# Altium schematic sheet Adapter.SchDoc
size A3; Address1: Address1; Address2: Address2; Address3: Address3; Address4: Address4
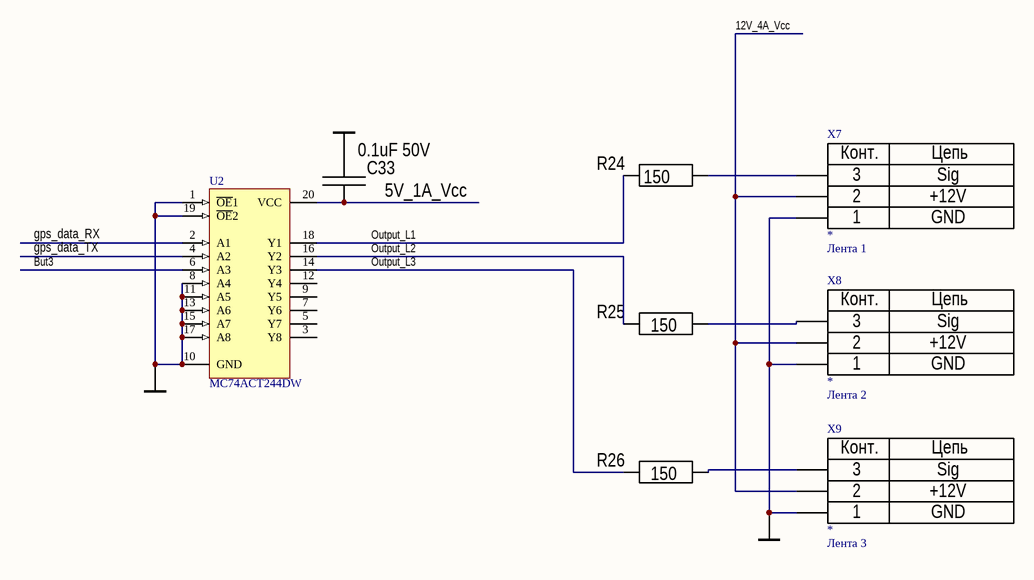
[diagram p0: Adapter.SchDoc]

## Parts
C33  0.1uF 50V  [0805_CAP]
R24  150  [0805_RES]
R25  150  [0805_RES]
R26  150  [0805_RES]
U2  MC74ACT244DW  [751D-04_N]
X7  *  Destiny: Лента 1  [3pad_5.08]
X8  *  Destiny: Лента 2  [3pad_5.08]
X9  *  Destiny: Лента 3  [3pad_5.08]

## Nets
GND: C33.2 U2.1(~{OE}1) U2.8(A4) U2.10(GND) U2.11(A5) U2.13(A6) U2.15(A7) U2.17(A8) U2.19(~{OE}2) X7.1 X8.1 X9.1
5V_1A_Vcc: C33.1 U2.20(VCC)
12V_4A_Vcc: X7.2 X8.2 X9.2
But3: U2.6(A3)
gps_data_RX: U2.2(A1)
gps_data_TX: U2.4(A2)
Output_L1: R24.1 U2.18(Y1)
Output_L2: R25.1 U2.16(Y2)
Output_L3: R26.1 U2.14(Y3)
NetR24_2: R24.2 X7.3
NetR25_2: R25.2 X8.3
NetR26_2: R26.2 X9.3

Not connected (* = marked no-connect by the designer): U2 3(Y8) 5(Y7) 7(Y6) 9(Y5) 12(Y4)

## Notes on the sheet
- Title
- Size:
- Date:
- A3
- Number:
- Time:
- Revision:
- Sheet
- of
- File:
- (in symbol 3pin_conn) Конт.; Цепь

## Library data of the parts
C33 = Cap_np: Value: 0.1uF 50V
R24-R26 = Res: Value: 150
U2 = MC74ACT244DW: Octal Buffer/Line Driver with 3-State Outputs; Published: 15-Apr-2002; LatestRevisionDate: 13-Apr-2006; LatestRevisionNote: IPC-7351 Footprint Added.; DatasheetVersion: 9-Apr-1996; PackageReference: 751D-04; Publisher: Altium Limited; PackageDescription: 20-Pin Small Outline Integrated Circuit 1.27 mm Pitch; ComponentLink1Description: Manufacturer Link; ComponentLink1URL: http://www.onsemi.com/; ComponentLink2Description: Datasheet; ComponentLink2URL: http://www.onsemi.com/pub/Collateral/MC74AC244-D.PDF
X7-X9 = 3pin_conn: PinName1: GND; PinName2: +12V; PinName3: Sig; Value: *